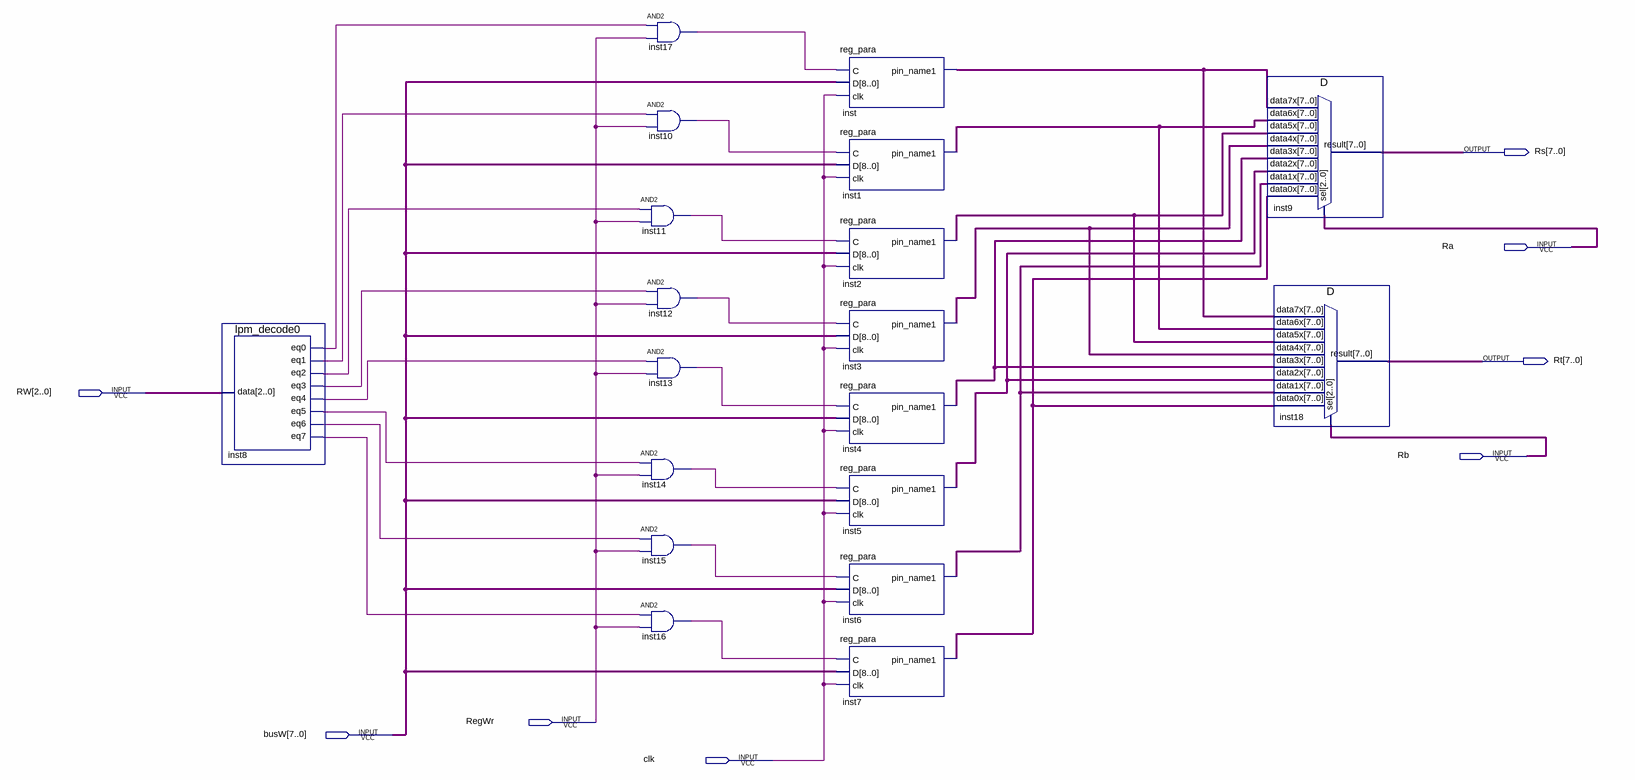
[diagram p0: schematic sheet]
// Quartus schematic bancDeRegistre.bdf as structural Verilog: 19 symbols, 8 pins
module bancDeRegistre (
  input  Ra,
  input  [2:0] RW,
  input  Rb,
  input  RegWr,
  input  [7:0] busW,
  input  clk,
  output [7:0] Rs,
  output [7:0] Rt
);

  wire inst8_eq0, inst8_eq1, inst8_eq2, inst8_eq3, inst8_eq4, inst8_eq5, inst8_eq6, inst8_eq7, inst10_out,
       inst11_out, inst12_out, inst13_out, inst14_out, inst15_out, inst16_out, inst17_out;
  wire [2:0] undriven, undriven_2;
  wire [7:0] inst1_pin_name1, inst2_pin_name1, inst3_pin_name1, inst4_pin_name1, inst5_pin_name1,
       inst6_pin_name1, inst7_pin_name1, inst_pin_name1;

  lpm_decode0 inst8 (
    .data(RW), .eq0(inst8_eq0), .eq1(inst8_eq1), .eq2(inst8_eq2), .eq3(inst8_eq3), .eq4(inst8_eq4),
    .eq5(inst8_eq5), .eq6(inst8_eq6), .eq7(inst8_eq7));
  and inst17 (inst17_out, inst8_eq0, RegWr);
  and inst10 (inst10_out, inst8_eq1, RegWr);
  and inst11 (inst11_out, inst8_eq2, RegWr);
  and inst12 (inst12_out, inst8_eq3, RegWr);
  and inst13 (inst13_out, inst8_eq4, RegWr);
  and inst14 (inst14_out, inst8_eq5, RegWr);
  and inst15 (inst15_out, inst8_eq6, RegWr);
  and inst16 (inst16_out, inst8_eq7, RegWr);
  reg_para inst (.C(inst17_out), .D(busW), .clk(clk), .pin_name1(inst_pin_name1));
  reg_para inst1 (.C(inst10_out), .D(busW), .clk(clk), .pin_name1(inst1_pin_name1));
  reg_para inst2 (.C(inst11_out), .D(busW), .clk(clk), .pin_name1(inst2_pin_name1));
  reg_para inst3 (.C(inst12_out), .D(busW), .clk(clk), .pin_name1(inst3_pin_name1));
  reg_para inst4 (.C(inst13_out), .D(busW), .clk(clk), .pin_name1(inst4_pin_name1));
  reg_para inst5 (.C(inst14_out), .D(busW), .clk(clk), .pin_name1(inst5_pin_name1));
  reg_para inst6 (.C(inst15_out), .D(busW), .clk(clk), .pin_name1(inst6_pin_name1));
  reg_para inst7 (.C(inst16_out), .D(busW), .clk(clk), .pin_name1(inst7_pin_name1));
  D inst9 (
    .data7x(inst_pin_name1), .data6x(inst1_pin_name1), .data5x(inst2_pin_name1), .data4x(inst3_pin_name1),
    .data3x(inst4_pin_name1), .data2x(inst5_pin_name1), .data1x(inst6_pin_name1), .data0x(inst7_pin_name1),
    .sel(undriven), .result(Rs));
  D inst18 (
    .data7x(inst_pin_name1), .data6x(inst1_pin_name1), .data5x(inst2_pin_name1), .data4x(inst3_pin_name1),
    .data3x(inst4_pin_name1), .data2x(inst5_pin_name1), .data1x(inst6_pin_name1), .data0x(inst7_pin_name1),
    .sel(undriven_2), .result(Rt));
endmodule
